# Altium schematic sheet 02_POWER_SYSTEMS.SchDoc
size A4; SheetNumber: 2; SheetTotal: 3
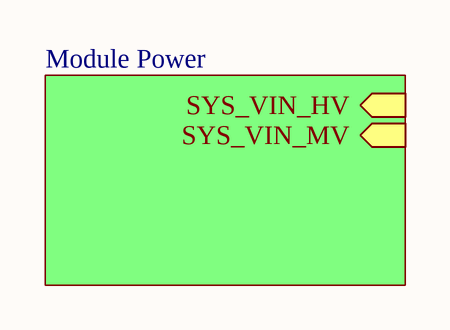
[diagram p0: 02_POWER_SYSTEMS.SchDoc]

## Sub-sheets
Module Power = 03_MODULE_POWER: SYS_VIN_HV (in), SYS_VIN_MV (in)